# EAGLE schematic PlayerBottom (EAGLE 9.6.1)
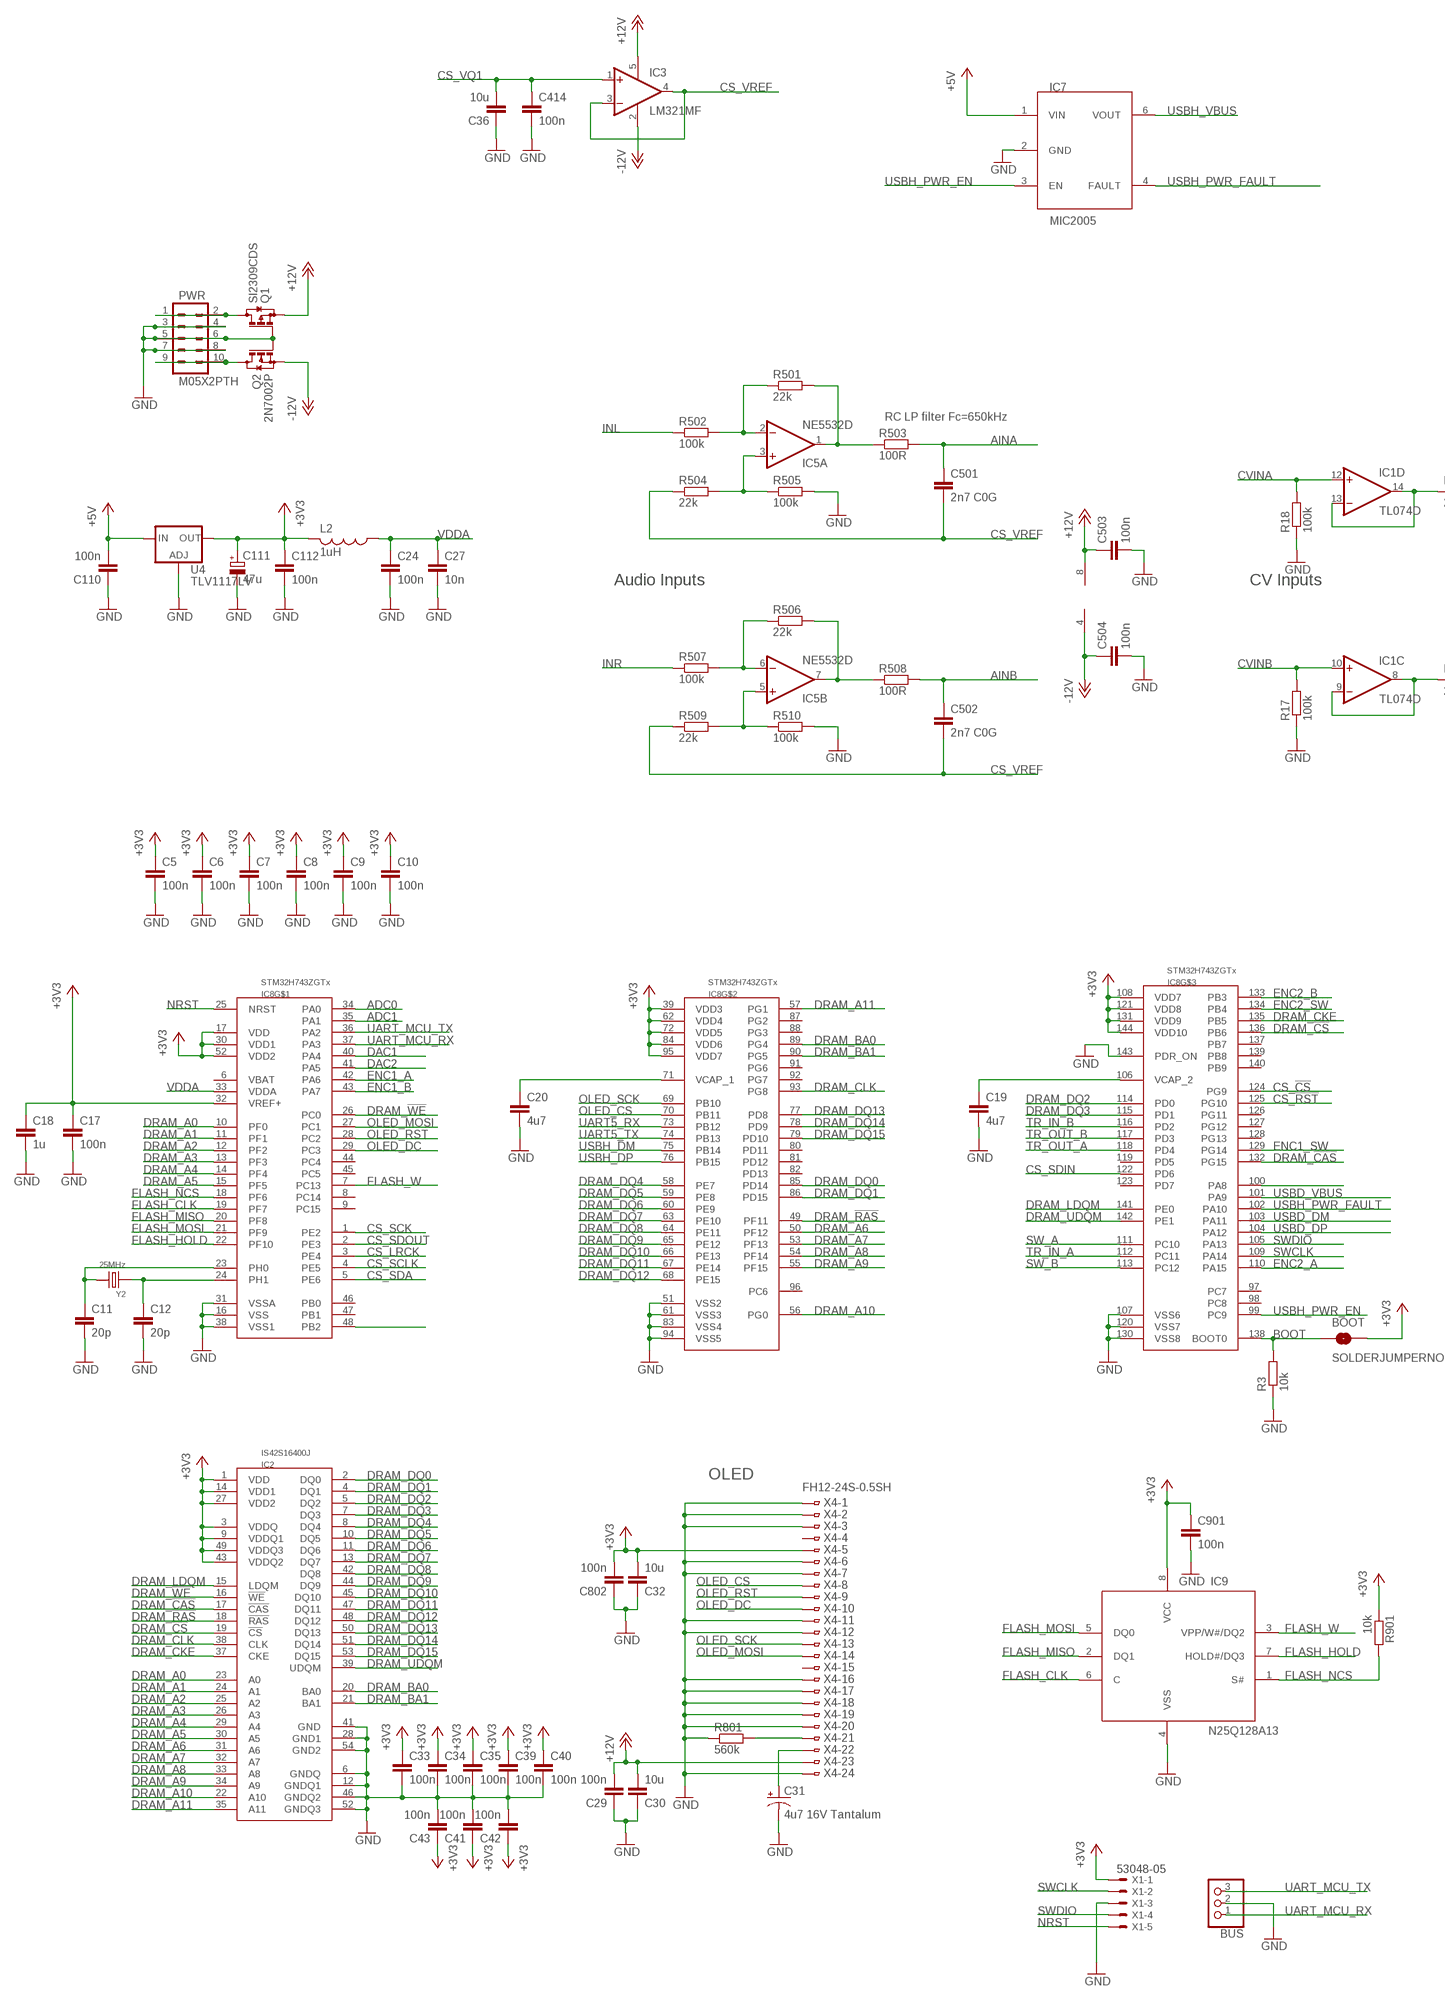
[diagram p0: schematic, sheet 1, part 1 of 2]
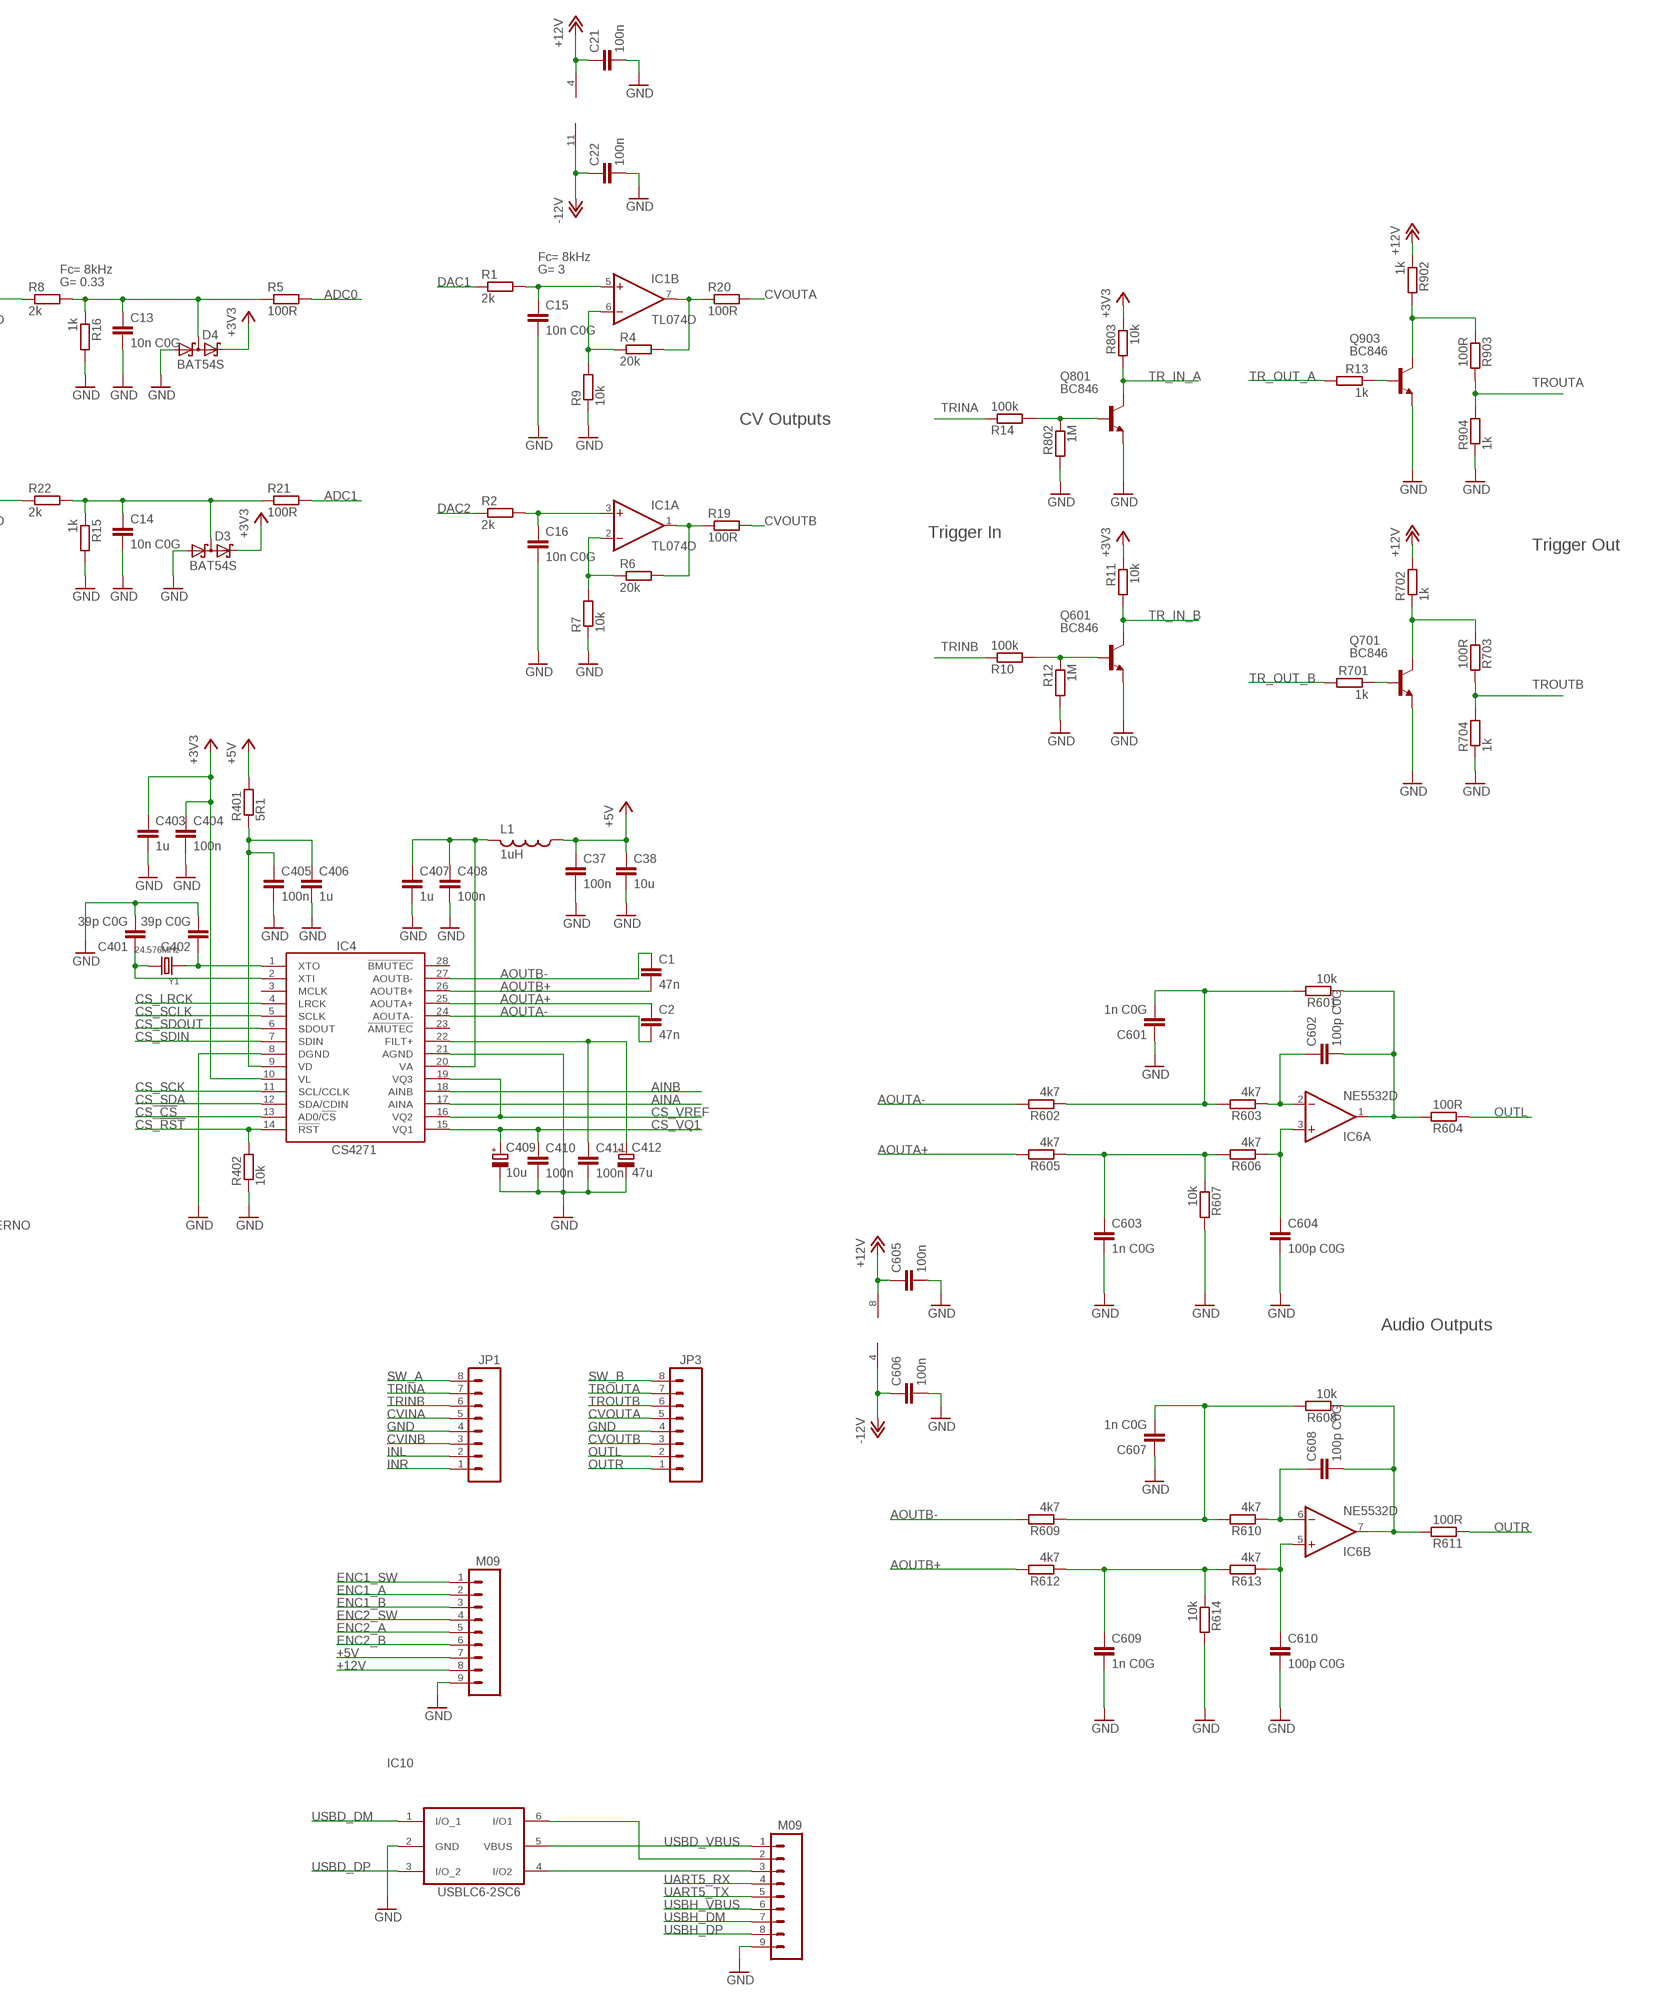
[diagram p1: schematic, sheet 1, part 2 of 2]

## Parts
BOOT  SOLDERJUMPERNO  [SJ_2S-NO]
BUS  CON-JST-1X03PH-TH  [JST-B3B-PH-KL]
C1  47n  C-EUC0603  [C0603]
C2  47n  C-EUC0603  [C0603]
C5  100n  C-EUC0603  [C0603]
C6  100n  C-EUC0603  [C0603]
C7  100n  C-EUC0603  [C0603]
C8  100n  C-EUC0603  [C0603]
C9  100n  C-EUC0603  [C0603]
C10  100n  C-EUC0603  [C0603]
C11  20p  C-EUC0603  [C0603]
C12  20p  C-EUC0603  [C0603]
C13  10n C0G  C-EUC0603  [C0603]
C14  10n C0G  C-EUC0603  [C0603]
C15  10n C0G  C-EUC0603  [C0603]
C16  10n C0G  C-EUC0603  [C0603]
C17  100n  C-EUC0603  [C0603]
C18  1u  C-EUC0603  [C0603]
C19  4u7  C-EUC0603  [C0603]
C20  4u7  C-EUC0603  [C0603]
C21  100n  C-EUC0603  [C0603]
C22  100n  C-EUC0603  [C0603]
C24  100n  C-EUC0603  [C0603]
C27  10n  C-EUC0603  [C0603]
C29  100n  C-EUC0603  [C0603]
C30  10u  C-EUC1206  [C1206]
C31  4u7 16V Tantalum  CAP_POL1206  [EIA3216]
C32  10u  C-EUC1206  [C1206]
C33  100n  C-EUC0603  [C0603]
C34  100n  C-EUC0603  [C0603]
C35  100n  C-EUC0603  [C0603]
C36  10u  C-EUC1206  [C1206]
C37  100n  C-EUC0603  [C0603]
C38  10u  C-EUC1206  [C1206]
C39  100n  C-EUC0603  [C0603]
C40  100n  C-EUC0603  [C0603]
C41  100n  C-EUC0603  [C0603]
C42  100n  C-EUC0603  [C0603]
C43  100n  C-EUC0603  [C0603]
C110  100n  C-EUC0603  [C0603]
C111  47u  CPOL-EU153CLV-0505  [CPOL-5]
C112  100n  C-EUC0603  [C0603]
C401  39p C0G  C-EUC0603  [C0603]
C402  39p C0G  C-EUC0603  [C0603]
C403  1u  C-EUC0603  [C0603]
C404  100n  C-EUC0603  [C0603]
C405  100n  C-EUC0603  [C0603]
C406  1u  C-EUC0603  [C0603]
C407  1u  C-EUC0603  [C0603]
C408  100n  C-EUC0603  [C0603]
C409  10u  CPOL-EU153CLV-0505  [CPOL-5]
C410  100n  C-EUC0603  [C0603]
C411  100n  C-EUC0603  [C0603]
C412  47u  CPOL-EU153CLV-0505  [CPOL-5]
C414  100n  C-EUC0603  [C0603]
C501  2n7 C0G  C-EUC0603  [C0603]
C502  2n7 C0G  C-EUC0603  [C0603]
C503  100n  C-EUC0603  [C0603]
C504  100n  C-EUC0603  [C0603]
C601  1n C0G  C-EUC0603  [C0603]
C602  100p C0G  C-EUC0603  [C0603]
C603  1n C0G  C-EUC0603  [C0603]
C604  100p C0G  C-EUC0603  [C0603]
C605  100n  C-EUC0603  [C0603]
C606  100n  C-EUC0603  [C0603]
C607  1n C0G  C-EUC0603  [C0603]
C608  100p C0G  C-EUC0603  [C0603]
C609  1n C0G  C-EUC0603  [C0603]
C610  100p C0G  C-EUC0603  [C0603]
C802  100n  C-EUC0603  [C0603]
C901  100n  C-EUC0603  [C0603]
D3  BAT54S  [SOT23]
D4  BAT54S  [SOT23]
IC1  TL074D  [SO14]
IC2  IS42S16400J  [TSOP54-400]
IC3  LM321MF  [SOT23-5]
IC4  CS4271  [TSSOP28-0.65-9.7X4.4MM]
IC5  NE5532D  [SO08]
IC6  NE5532D  [SO08]
IC7  MIC2005  [SOT23-6]
IC8  STM32H743ZGTx  STM32F42XZ/43XZ(144PIN)LQFP144  [QFP50P2200X2200X160-144N]
IC9  N25Q128A13  [SO8W]
IC10  USBLC6-2SC6  [SOT-23-6L]
JP1  M081X08  [1X08]
JP2  M09  [1X09]
JP3  M081X08  [1X08]
JP4  M09  [1X09]
L1  1uH  INDUCTOR  [0603]
L2  1uH  INDUCTOR  [0603]
PWR  M05X2PTH  [AVR_ICSP]
Q1  SI2309CDS  BSS84  [SOT23]
Q2  2N7002P  BSS123  [SOT23]
Q601  BC846  [SOT23]
Q701  BC846  [SOT23]
Q801  BC846  [SOT23]
Q903  BC846  [SOT23]
R1  2k  R-EU_0603  [0603]
R2  2k  R-EU_0603  [0603]
R3  10k  R-EU_0603  [0603]
R4  20k  R-EU_0603  [0603]
R5  100R  R-EU_0603  [0603]
R6  20k  R-EU_0603  [0603]
R7  10k  R-EU_0603  [0603]
R8  2k  R-EU_0603  [0603]
R9  10k  R-EU_0603  [0603]
R10  100k  R-EU_0603  [0603]
R11  10k  R-EU_0603  [0603]
R12  1M  R-EU_0603  [0603]
R13  1k  R-EU_0603  [0603]
R14  100k  R-EU_0603  [0603]
R15  1k  R-EU_0603  [0603]
R16  1k  R-EU_0603  [0603]
R17  100k  R-EU_0603  [0603]
R18  100k  R-EU_0603  [0603]
R19  100R  R-EU_0603  [0603]
R20  100R  R-EU_0603  [0603]
R21  100R  R-EU_0603  [0603]
R22  2k  R-EU_0603  [0603]
R401  5R1  R-EU_0603  [0603]
R402  10k  R-EU_0603  [0603]
R501  22k  R-EU_0603  [0603]
R502  100k  R-EU_0603  [0603]
R503  100R  R-EU_0603  [0603]
R504  22k  R-EU_0603  [0603]
R505  100k  R-EU_0603  [0603]
R506  22k  R-EU_0603  [0603]
R507  100k  R-EU_0603  [0603]
R508  100R  R-EU_0603  [0603]
R509  22k  R-EU_0603  [0603]
R510  100k  R-EU_0603  [0603]
R601  10k  R-EU_0603  [0603]
R602  4k7  R-EU_0603  [0603]
R603  4k7  R-EU_0603  [0603]
R604  100R  R-EU_0603  [0603]
R605  4k7  R-EU_0603  [0603]
R606  4k7  R-EU_0603  [0603]
R607  10k  R-EU_0603  [0603]
R608  10k  R-EU_0603  [0603]
R609  4k7  R-EU_0603  [0603]
R610  4k7  R-EU_0603  [0603]
R611  100R  R-EU_0603  [0603]
R612  4k7  R-EU_0603  [0603]
R613  4k7  R-EU_0603  [0603]
R614  10k  R-EU_0603  [0603]
R701  1k  R-EU_0603  [0603]
R702  1k  R-EU_0603  [0603]
R703  100R  R-EU_0603  [0603]
R704  1k  R-EU_0603  [0603]
R801  560k  R-EU_0603  [0603]
R802  1M  R-EU_0603  [0603]
R803  10k  R-EU_0603  [0603]
R901  10k  R-EU_0603  [0603]
R902  1k  R-EU_0603  [0603]
R903  100R  R-EU_0603  [0603]
R904  1k  R-EU_0603  [0603]
U4  TLV1117LV  LD117AS33TR  [SOT223]
X1  53048-05  [53048-05]
X4  FH12-24S-0.5SH  [FH12-24S-0.5SH]
Y1  24.576MHz  SMD-CRYSTAL-8MHZ-20PF-20PPM(2P-5.0X3.2MM)  [X2-SMD-5.0X3.2X1.3MM]
Y2  25MHz  SMD-CRYSTAL-8MHZ-20PF-20PPM(2P-5.0X3.2MM)  [X2-SMD-5.0X3.2X1.3MM]

## Nets
+3.3V [power]: BOOT.2 C5.1 C6.1 C7.1 C8.1 C9.1 C10.1 C17.1 C18.1 C32.2 C33.1 C34.1 C35.1 C39.1 C40.1 C41.1 C42.1 C43.1 C111.+ C112.1 C403.1 C404.1 C802.2 C901.1 D3.2(C2) D4.2(C2) IC2.1(VDD) IC2.3(VDDQ) IC2.9(VDDQ1) IC2.14(VDD1) IC2.27(VDD2) IC2.43(VDDQ2) IC2.49(VDDQ3) IC4.10(VL) IC8.17(VDD) IC8.30(VDD1) IC8.32(VREF+) IC8.39(VDD3) IC8.52(VDD2) IC8.62(VDD4) IC8.72(VDD5) IC8.84(VDD6) IC8.95(VDD7) IC8.108(VDD7) IC8.121(VDD8) IC8.131(VDD9) IC8.144(VDD10) IC9.8(VCC) L2.2 R11.1 R803.1 R901.1 U4.4(OUT) X1.1 X4.5 ; supply symbol labelled +3V3
+5V [power]: C37.1 C38.1 C110.2 IC7.1(VIN) JP4.7 L1.1 R401.2 U4.3(IN)
+12V: C21.1 C29.2 C30.2 C503.1 C605.1 IC1.4(P:V+) IC3.5(V+) IC5.8(P:V+) IC6.8(P:V+) JP4.8 Q1.2(S) R702.2 R902.1 X4.23
-12V: C22.1 C504.1 C606.1 IC1.11(P:V-) IC3.2(V-) IC5.4(P:V-) IC6.4(P:V-) Q2.2(S)
ADC0: IC8.34(PA0) R5.2
ADC1: IC8.35(PA1) R21.2
AINA: C501.1 IC4.17(AINA) R503.2
AINB: C502.1 IC4.18(AINB) R508.2
ANALOG_OUTA: C602.2 IC6.1(A:OUT) R601.1 R604.2
ANALOG_OUTB: C608.2 IC6.7(B:OUT) R608.1 R611.2
AOUTA+: C2.1 IC4.25(AOUTA+) R605.2
AOUTA-: C2.2 IC4.24(AOUTA-) R602.2
AOUTB+: C1.2 IC4.26(AOUTB+) R612.2
AOUTB-: C1.1 IC4.27(AOUTB-) R609.2
BOOT: BOOT.1 IC8.138(BOOT0) R3.2
CS_!CS: IC4.13(AD0/!CS) IC8.124(PG9)
CS_!RST: IC4.14(!RST) IC8.125(PG10) R402.2
CS_LRCK: IC4.4(LRCK) IC8.3(PE4)
CS_SCK: IC4.11(SCL/CCLK) IC8.1(PE2)
CS_SCLK: IC4.5(SCLK) IC8.4(PE5)
CS_SDA: IC4.12(SDA/CDIN) IC8.5(PE6)
CS_SDIN: IC4.7(SDIN) IC8.122(PD6)
CS_SDOUT: IC4.6(SDOUT) IC8.2(PE3)
CS_VQ1: C36.2 C409.+ C410.1 C414.1 IC3.1(+IN) IC4.15(VQ1)
CS_VREF: C501.2 C502.2 IC3.3(-IN) IC3.4(OUT) IC4.16(VQ2) IC4.19(VQ3) R504.1 R509.1
CVINA: IC1.12(D:+IN) JP1.5 R18.2
CVINB: IC1.10(C:+IN) JP1.3 R17.2
CVOUTA: JP3.5 R20.2
CVOUTB: JP3.3 R19.2
DAC1: IC8.40(PA4) R1.1
DAC2: IC8.41(PA5) R2.1
DRAM_!CAS: IC2.17(!CAS) IC8.132(PG15)
DRAM_!CS: IC2.19(!CS) IC8.136(PB6)
DRAM_!RAS: IC2.18(!RAS) IC8.49(PF11)
DRAM_!WE: IC2.16(!WE) IC8.26(PC0)
DRAM_A0: IC2.23(A0) IC8.10(PF0)
DRAM_A1: IC2.24(A1) IC8.11(PF1)
DRAM_A2: IC2.25(A2) IC8.12(PF2)
DRAM_A3: IC2.26(A3) IC8.13(PF3)
DRAM_A4: IC2.29(A4) IC8.14(PF4)
DRAM_A5: IC2.30(A5) IC8.15(PF5)
DRAM_A6: IC2.31(A6) IC8.50(PF12)
DRAM_A7: IC2.32(A7) IC8.53(PF13)
DRAM_A8: IC2.33(A8) IC8.54(PF14)
DRAM_A9: IC2.34(A9) IC8.55(PF15)
DRAM_A10: IC2.22(A10) IC8.56(PG0)
DRAM_A11: IC2.35(A11) IC8.57(PG1)
DRAM_BA0: IC2.20(BA0) IC8.89(PG4)
DRAM_BA1: IC2.21(BA1) IC8.90(PG5)
DRAM_CKE: IC2.37(CKE) IC8.135(PB5)
DRAM_CLK: IC2.38(CLK) IC8.93(PG8)
DRAM_DQ0: IC2.2(DQ0) IC8.85(PD14)
DRAM_DQ1: IC2.4(DQ1) IC8.86(PD15)
DRAM_DQ2: IC2.5(DQ2) IC8.114(PD0)
DRAM_DQ3: IC2.7(DQ3) IC8.115(PD1)
DRAM_DQ4: IC2.8(DQ4) IC8.58(PE7)
DRAM_DQ5: IC2.10(DQ5) IC8.59(PE8)
DRAM_DQ6: IC2.11(DQ6) IC8.60(PE9)
DRAM_DQ7: IC2.13(DQ7) IC8.63(PE10)
DRAM_DQ8: IC2.42(DQ8) IC8.64(PE11)
DRAM_DQ9: IC2.44(DQ9) IC8.65(PE12)
DRAM_DQ10: IC2.45(DQ10) IC8.66(PE13)
DRAM_DQ11: IC2.47(DQ11) IC8.67(PE14)
DRAM_DQ12: IC2.48(DQ12) IC8.68(PE15)
DRAM_DQ13: IC2.50(DQ13) IC8.77(PD8)
DRAM_DQ14: IC2.51(DQ14) IC8.78(PD9)
DRAM_DQ15: IC2.53(DQ15) IC8.79(PD10)
DRAM_LDQM: IC2.15(LDQM) IC8.141(PE0)
DRAM_UDQM: IC2.39(UDQM) IC8.142(PE1)
ENC1_A: IC8.42(PA6) JP4.2
ENC1_B: IC8.43(PA7) JP4.3
ENC1_SW: IC8.129(PG14) JP4.1
ENC2_A: IC8.110(PA15) JP4.5
ENC2_B: IC8.133(PB3) JP4.6
ENC2_SW: IC8.134(PB4) JP4.4
FLASH_CLK: IC8.19(PF7) IC9.6(C)
FLASH_HOLD: IC8.22(PF10) IC9.7(HOLD#/DQ3)
FLASH_MISO: IC8.20(PF8) IC9.2(DQ1)
FLASH_MOSI: IC8.21(PF9) IC9.5(DQ0)
FLASH_NCS: IC8.18(PF6) IC9.1(S#) R901.2
FLASH_W: IC8.7(PC13) IC9.3(VPP/W#/DQ2)
GND: BUS.2 C5.2 C6.2 C7.2 C8.2 C9.2 C10.2 C11.2 C12.2 C13.2 C14.2 C15.2 C16.2 C17.2 C18.2 C19.2 C20.2 C21.2 C22.2 C24.2 C27.2 C29.1 C30.1 C31.C(-) C32.1 C33.2 C34.2 C35.2 C36.1 C37.2 C38.2 C39.2 C40.2 C41.2 C42.2 C43.2 C110.1 C111.- C112.2 C401.2 C402.2 C403.2 C404.2 C405.2 C406.2 C407.2 C408.2 C409.- C410.2 C411.2 C412.- C414.2 C503.2 C504.2 C601.1 C603.2 C604.2 C605.2 C606.2 C607.1 C609.2 C610.2 C802.1 C901.2 D3.1(A1) D4.1(A1) IC2.6(GNDQ) IC2.12(GNDQ1) IC2.28(GND1) IC2.41(GND) IC2.46(GNDQ2) IC2.52(GNDQ3) IC2.54(GND2) IC4.8(DGND) IC4.21(AGND) IC7.2(GND) IC8.16(VSS) IC8.31(VSSA) IC8.38(VSS1) IC8.51(VSS2) IC8.61(VSS3) IC8.83(VSS4) IC8.94(VSS5) IC8.107(VSS6) IC8.120(VSS7) IC8.130(VSS8) IC8.143(PDR_ON) IC9.4(VSS) IC10.2(GND) JP1.4 JP2.9 JP3.4 JP4.9 PWR.3 PWR.4 PWR.5 PWR.6 PWR.7 PWR.8 Q1.1(G) Q2.1(G) Q601.2(E) Q701.2(E) Q801.2(E) Q903.2(E) R3.1 R7.1 R9.1 R12.2 R15.2 R16.2 R17.1 R18.1 R402.1 R505.2 R510.2 R607.2 R614.2 R704.1 R801.1 R802.2 R904.1 U4.1(ADJ) X1.3 X4.1 X4.2 X4.3 X4.6 X4.7 X4.11 X4.12 X4.16 X4.17 X4.18 X4.19 X4.20 X4.24
INL: JP1.2 R502.1
INR: JP1.1 R507.1
N$1: C603.1 R605.1 R606.2 R607.1
N$2: C13.1 D4.3(C1A2) R5.1 R8.2 R16.1
N$3: C407.1 C408.1 IC4.20(VA) L1.2
N$4: IC1.7(B:OUT) R4.2 R20.1
N$5: IC1.8(C:OUT) IC1.9(C:-IN) R22.1
N$6: C31.A(+) X4.22
N$7: PWR.9 PWR.10 Q2.3(D)
N$8: R801.2 X4.21
N$9: PWR.1 PWR.2 Q1.3(D)
N$10: C601.2 R601.2 R602.1 R603.2
N$11: C12.1 IC8.24(PH1) Y2.1
N$12: IC1.2(A:-IN) R6.1 R7.2
N$13: C602.1 IC6.2(A:-IN) R603.1
N$14: C604.1 IC6.3(A:+IN) R606.1
N$15: IC1.6(B:-IN) R4.1 R9.2
N$17: C11.1 IC8.23(PH0) Y2.2
N$18: C402.1 IC4.1(XTO) Y1.1
N$19: IC10.6(I/O1) JP2.2
N$20: C411.1 C412.+ IC4.22(FILT+)
N$21: C401.1 IC4.2(XTI) Y1.2
N$22: C14.1 D3.3(C1A2) R15.1 R21.1 R22.2
N$25: C609.1 R612.1 R613.2 R614.1
N$26: C607.2 R608.2 R609.1 R610.2
N$27: C608.1 IC6.6(B:-IN) R610.1
N$28: C610.1 IC6.5(B:+IN) R613.1
N$30: IC1.13(D:-IN) IC1.14(D:OUT) R8.1
N$31: C16.1 IC1.3(A:+IN) R2.2
N$32: IC1.1(A:OUT) R6.2 R19.1
N$33: C19.1 IC8.106(VCAP_2)
N$34: C20.1 IC8.71(VCAP_1)
N$36: IC5.3(A:+IN) R504.2 R505.1
N$37: Q601.1(B) R10.2 R12.1
N$38: IC5.2(A:-IN) R501.1 R502.2
N$39: Q701.1(B) R701.1
N$40: IC5.1(A:OUT) R501.2 R503.1
N$41: Q701.3(C) R702.1 R703.1
N$42: IC5.5(B:+IN) R509.2 R510.1
N$43: IC5.6(B:-IN) R506.1 R507.2
N$44: C15.1 IC1.5(B:+IN) R1.2
N$45: IC5.7(B:OUT) R506.2 R508.1
N$46: IC8.48(PB2)
N$47: Q903.1(B) R13.1
N$48: IC8.100(PA8)
N$51: Q903.3(C) R902.2 R903.1
N$54: Q801.1(B) R14.2 R802.1
N$55: IC10.4(I/O2) JP2.3
NRST: IC8.25(NRST) X1.5
OLED_CS: IC8.70(PB11) X4.8
OLED_DC: IC8.29(PC3) X4.10
OLED_MOSI: IC8.27(PC1) X4.14
OLED_RST: IC8.28(PC2) X4.9
OLED_SCK: IC8.69(PB10) X4.13
OUTL: JP3.2 R604.1
OUTR: JP3.1 R611.1
SW_A: IC8.111(PC10) JP1.8
SW_B: IC8.113(PC12) JP3.8
SWCLK: IC8.109(PA14) X1.2
SWDIO: IC8.105(PA13) X1.4
TR_IN_A: IC8.112(PC11) Q801.3(C) R803.2
TR_IN_B: IC8.116(PD2) Q601.3(C) R11.2
TR_OUT_A: IC8.118(PD4) R13.2
TR_OUT_B: IC8.117(PD3) R701.2
TRINA: JP1.7 R14.1
TRINB: JP1.6 R10.1
TROUTA: JP3.7 R903.2 R904.2
TROUTB: JP3.6 R703.2 R704.2
UART5_RX: IC8.73(PB12) JP2.4
UART5_TX: IC8.74(PB13) JP2.5
UART_MCU_RX: BUS.1 IC8.37(PA3)
UART_MCU_TX: BUS.3 IC8.36(PA2)
USBD_DM: IC8.103(PA11) IC10.1(I/O_1)
USBD_DP: IC8.104(PA12) IC10.3(I/O_2)
USBD_VBUS: IC8.101(PA9) IC10.5(VBUS) JP2.1
USBH_DM: IC8.75(PB14) JP2.7
USBH_DP: IC8.76(PB15) JP2.8
USBH_PWR_EN: IC7.3(EN) IC8.99(PC9)
USBH_PWR_FAULT: IC7.4(FAULT) IC8.102(PA10)
USBH_VBUS: IC7.6(VOUT) JP2.6
VD: C405.1 C406.1 IC4.9(VD) R401.1
VDDA: C24.1 C27.1 IC8.33(VDDA) L2.1
Unconnected: IC4.3(MCLK) IC4.23(!AMUTEC) IC4.28(!BMUTEC) IC8.6(VBAT) IC8.8(PC14) IC8.9(PC15) IC8.44(PC4) IC8.45(PC5) IC8.46(PB0) IC8.47(PB1) IC8.80(PD11) IC8.81(PD12) IC8.82(PD13) IC8.87(PG2) IC8.88(PG3) IC8.91(PG6) IC8.92(PG7) IC8.96(PC6) IC8.97(PC7) IC8.98(PC8) IC8.119(PD5) IC8.123(PD7) IC8.126(PG11) IC8.127(PG12) IC8.128(PG13) IC8.137(PB7) IC8.139(PB8) IC8.140(PB9) X4.4 X4.15

## Notes on the sheet
- RC LP filter Fc=650kHz
- Fc= 8kHz
- Fc= 8kHz | G= 3
- G= 0.33
- Audio Inputs | CV Inputs
- CV Outputs
- Trigger In
- Trigger Out
- Audio Outputs
- OLED

## Library data of the parts
BOOT = SparkFun:SOLDERJUMPER: Solder Jumper Standard SMD solder jumper. Used to automate production. Two varients : Normally Open and Normally Closed are the same, but have different paste layers. NC will have a large amount of paste and should jumper during reflow.
BUS = Rebel:CON-JST-1X03
C1 C2 C5-C22 C24 C27 C29 C30 C32-C43 C110 C112 C401-C408 C410 C411 C414 C501-C504 C601-C610 C802 C901 = Rebel:C-EU: CAPACITOR, European symbol
C31 = smartplug:CAP_POL: Capacitor Polarized These are standard SMD and PTH capacitors. Normally 10uF, 47uF, and 100uF in electrolytic and tantalum varieties. Always verify the external diameter of the through hole cap, it varies with capacity, voltage, and manufacturer. The EIA devices should be standard.
C111 C409 C412 = Rebel:CPOL-EU: POLARIZED CAPACITOR, European symbol
D3 D4 = diode:BAT54S: Schottky Diodes Pin connection corrected 2011-05-04 Source: Fairchild .. BAT54.pdf
IC1 = linear:TL074: OP AMP
IC2 = James:IS42S16400J; OC_FARNELL: 2253831
IC3 = linear:LM321?*: Low Power Single Op Amp Source: http://cache.national.com/ds/LM/LM321.pdf
IC4 = Rebel:CS4271
IC5 IC6 = linear:NE5532: AUDIO AMPLIFIER
IC7 = James:MIC2005; OC_FARNELL: 2509882
IC8 = Rebel:STM32F42XZ/43XZ(144PIN); OC_FARNELL: 2484975
IC9 = Rebel:N25Q128A13: N25Q128A13 Flash Memory SO8W; OC_FARNELL: 2253682
IC10 = usblc6:USBLC6-2: VERY LOW CAPACITANCE ESD PROTECTION 2 line Datasheet link <http://www.st.com/web/catalog/sense_power/FM114/CL1137/SC1489/PF93353>
JP1 JP3 = SparkFun:M08: Header 8 Standard 8-pin 0.1" header. Use with straight break away headers (SKU : PRT-00116), right angle break away headers (PRT-00553), swiss pins (PRT-00743), machine pins (PRT-00117), and female headers (PRT-00115).
JP2 JP4 = SparkFun:M09: Header 9 Standard 9-pin 0.1" header. Use with straight break away headers (SKU : PRT-00116), right angle break away headers (PRT-00553), swiss pins (PRT-00743), machine pins (PRT-00117), and female headers (PRT-00115).
L1 L2 = Rebel:INDUCTOR; OC_FARNELL: 2288736
PWR = SparkFun:M05X2: Header 5x2 Standard 10-pin dual row 0.1" header. Commonly used with AVR-ISP. Use with Spark Fun Electronics SKU: PRT-00778
Q1 = transistor-small-signal:BSS84: P-CHANNEL MOS FET; OC_FARNELL: 1779264
Q2 = transistor-small-signal:BSS123: N-CHANNEL MOS FET; OC_FARNELL: 1843725
Q601 Q701 Q801 Q903 = transistor:BC846: NPN TRANSISTOR
R1-R22 R401 R402 R501-R510 R601-R614 R701-R704 R801-R803 R901-R904 = Rebel:R-EU_: RESISTOR, European symbol
U4 = v-reg:LD117A?*: Low drop fixed and adjustable positive voltage regulators 1 A Source: http://www.st.com/stonline/products/literature/ds/7194/ld1117axx.pdf; OC_FARNELL: 1469104
X1 = con-molex:53?-05: CONNECTOR wire to board 1.25 mm (.049 inch) pitch header; MF: MOLEX; MPN: 53048-0510; OC_FARNELL: 9732926; OC_NEWARK: 57H4722
X4 = con-hirose:FH12-24S-0.5S: 0.5mm Pitch Connectors For FPC/FFC Source: Data sheet <http://www.hirose.co.jp/cataloge_hp/e58605370.pdf>; MPN: FH12-24S-0.5SH(55); OC_FARNELL: 1324552; OC_NEWARK: 34M6170
Y1 Y2 = Seeed-OPL-crystal-osctllator:SMD-CRYSTAL-8MHZ-20PF-20PPM(2P-5.0X3.2MM): 306010004; MPN: 5032/2P; VALUE: 5032/2p

## Net classes
1 power: width 0.178 mm, drill 0.305 mm, clearance 0.178 mm to class 0, clearance 0.178 mm